# EAGLE design board-Type-C-31-M-17 (EAGLE 9.6.2)
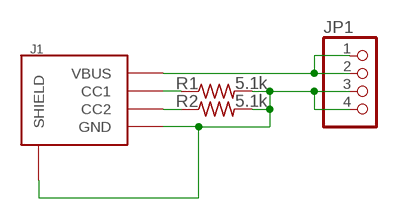
[diagram p0: schematic, sheet 1]

## Parts
J1  USB-TYPE-C-31-M-17  [USB-TYPE-C-31-M-17]
JP1  PINHD-1X4  [1X04]
R1  5.1k  RR0603  [R0603]
R2  5.1k  RR0603  [R0603]

## Nets
GND [power]: J1.GND J1.GND_2(GND) J1.SHLD-B1(SHIELD) J1.SHLD-B2(SHIELD) J1.SHLD-B3(SHIELD) J1.SHLD-B4(SHIELD) J1.SHLD-T1(SHIELD) J1.SHLD-T2(SHIELD) J1.SHLD-T3(SHIELD) J1.SHLD-T4(SHIELD) JP1.3 JP1.4 R1.2 R2.2
N$1: J1.CC1 R1.1
N$2: J1.CC2 R2.1
VBUS [power]: J1.VBUS J1.VBUS_2(VBUS) JP1.1 JP1.2

## Library data of the parts
J1 = angrypig7-Connectors:USB-TYPE-C-31-M-17: Type-C-31-M16/17 By Korean Hroparts Elec link <https://lcsc.com/product-detail/Others_Korean-Hroparts-Elec-TYPE-C-31-M-17_C283540.html>
JP1 = angrypig7-Connectors-PinHeads:PINHD-1X4: PIN HEADER
R1 R2 = angrypig7-RCL:R; SPICEPREFIX: R

## Net classes
0 default: width 0.254 mm
1 power: width 0.406 mm

## Board
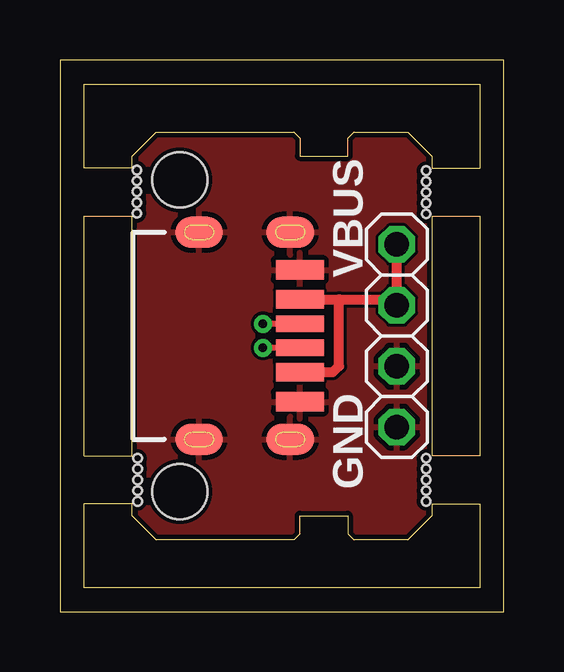
[diagram p1: board, top side]
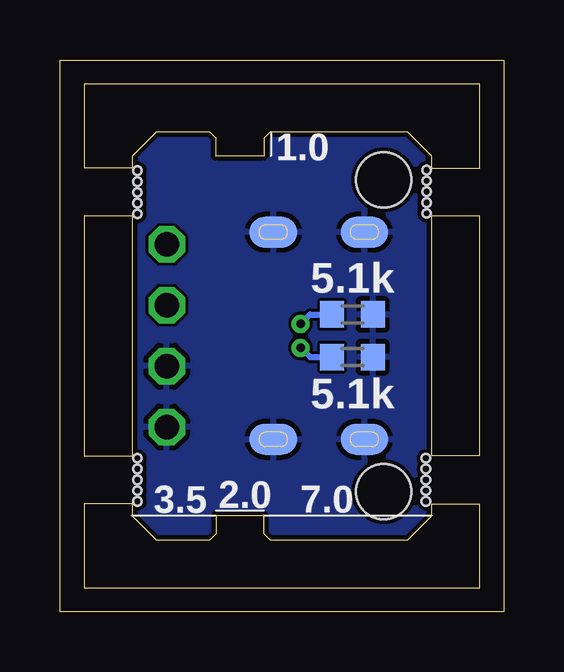
[diagram p2: board, bottom side, seen from below]

Size 18.5 x 23 mm. Coordinates in mm from the lower left corner, seen from the top.
Outline: 3,4 3,4.5 1,4.5 1,1 17.5,1 17.5,4.5 15.5,4.5 15.5,4 14.5,3 12.25,3 12,3.25 12,4 10,4 10,3.25 9.75,3 4,3 3,4
Outline: 3,6.5 3,16.5 1,16.5 1,6.5 3,6.5
Outline: 3,18.5 3,19 4,20 9.75,20 10,19.75 10,19 12,19 12,19.75 12.25,20 14.5,20 15.5,19 15.5,18.5 17.5,18.5 17.5,22 1,22 1,18.5 3,18.5
Outline: 15.5,16.5 15.5,6.5 17.5,6.5 17.5,16.5 15.5,16.5
Outline: 0,0 18.5,0 18.5,23 0,23 0,0
Copper layers (1*16): Top 0.035mm / dielectric 1.5mm / Bottom 0.035mm
Design rules "JLCPCB_2-Layer": minimum track width 5mil, minimum drill 0.2mm, track to track 5mil, track to pad 5mil, pad to pad 5mil, via to via 5mil, smd to smd 5mil, copper to edge 8mil, drill to drill 3mil, minimum pad ring 3mil, minimum via ring 0.2mm, stop-mask expansion 4mil, vias tented up to drill 15mil, thermal gap 8mil
Holes 2.3 mm at 5,18 5,5
Holes 0.35 mm at 3.21,18.41 3.21,17.96 3.21,17.51 3.21,17.06 3.21,16.61 15.27,18.38 15.27,17.93 15.27,17.48 15.27,17.03 15.27,16.58 15.27,6.39 15.27,5.94 15.27,5.49 15.27,5.04 15.27,4.59 3.23,6.39 3.23,5.94 3.23,5.49 3.23,5.04 3.23,4.59

### Footprints (pad centres in the part's own frame; a part is rotated, then mirrored left to right if it is on the bottom)
USB-TYPE-C-31-M-17 = smd 0.7 x 2: CC1 -0.5,0.4; CC2 0.5,0.4 | smd 0.8 x 2: GND -2.75,0.4; GND_2 2.75,0.4 | smd 1.3 x 2 bottom: SHLD-B1 -4.32,0; SHLD-B2 4.32,0; SHLD-B3 -4.32,-3.8; SHLD-B4 4.32,-3.8 | smd 1.3 x 2: SHLD-T1 -4.32,0; SHLD-T2 4.32,0; SHLD-T3 -4.32,-3.8; SHLD-T4 4.32,-3.8 | smd 0.76 x 2: VBUS -1.52,0.4; VBUS_2 1.52,0.4
1X04 = drill 1.016 octagon: 1 -3.81,0; 2 -1.27,0; 3 1.27,0; 4 3.81,0
R0603 = smd 1 x 1.1: 1 -0.85,0; 2 0.85,0

### Placement (x,y rotation side)
J1  9.6,11.5 270 top
JP1  14.05,11.5 270 top
R1  6.3,12.39 0 bottom
R2  6.3,10.61 0 bottom

### Tracks (layer width: path | path; a pad name or v marks a point on that pad's centre or on a via)
GND
  pour Top: 15.25,3.13 3.25,3.13 3.25,19.87 15.25,19.87
  pour Bottom: 15.25,3.13 3.25,3.13 3.25,19.87 15.25,19.87
N$1  (via drill 0.35)
  Top 0.254: J1.CC1 v8.46,12
  Bottom 0.254: R1.1 8.07,12.39 v8.46,12
N$2  (via drill 0.35)
  Top 0.254: J1.CC2 v8.46,11
  Bottom 0.254: R2.1 8.07,10.61 v8.46,11
VBUS
  Top 0.406: J1.VBUS 11.64,13.02 | J1.VBUS_2 11.38,9.98 11.64,10.24 11.64,13.02 | 11.64,13.02 13.8,13.02 JP1.2 JP1.1

### Text on the board
tPlace: VBUS | GND
bPlace: 1.0 | 7.0 | 2.0 | 3.5